# EAGLE design test_station (EAGLE 5.11)
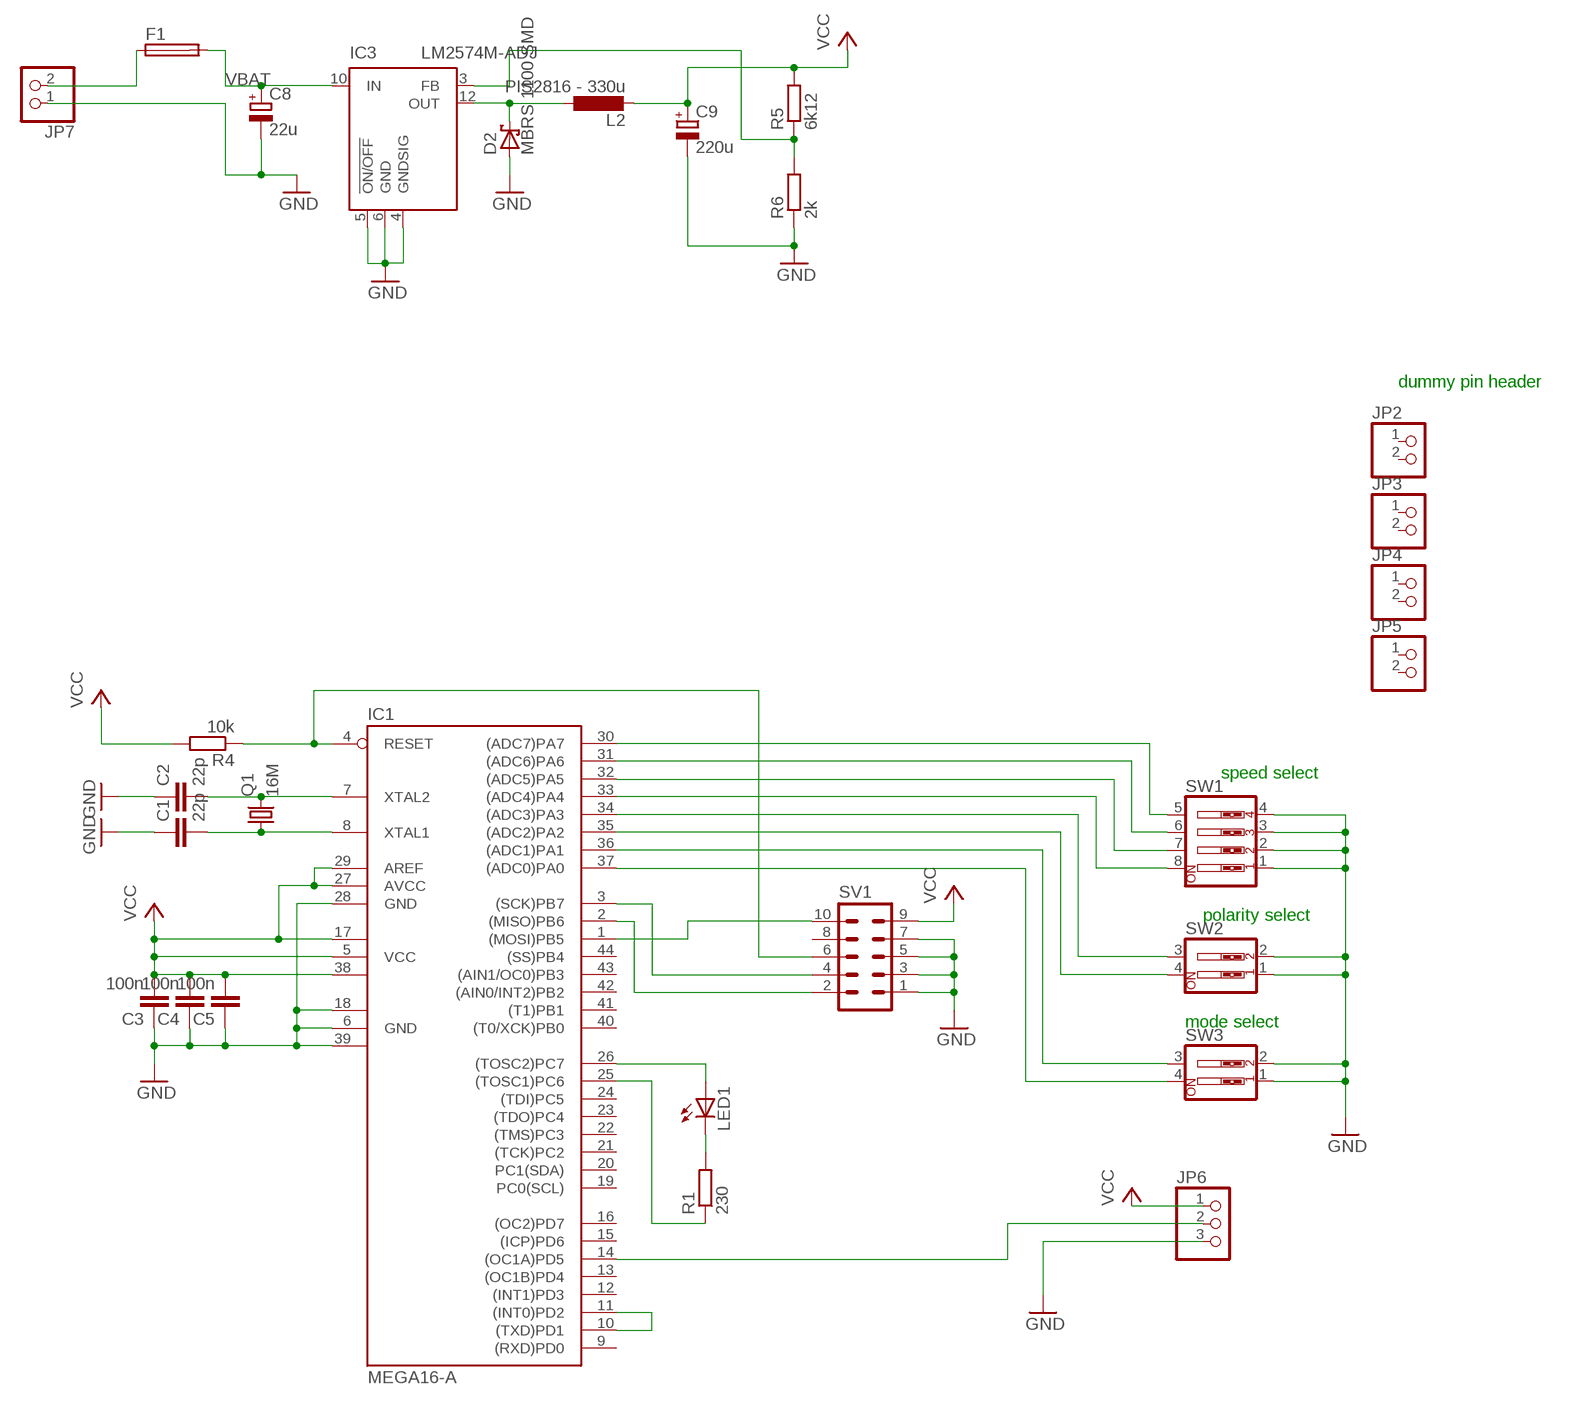
[diagram p0: schematic, sheet 1]

## Parts
C1  22p  C-EUC0805  [C0805]
C2  22p  C-EUC0805  [C0805]
C3  100n  C-EUC0805  [C0805]
C4  100n  C-EUC0805  [C0805]
C5  100n  C-EUC0805  [C0805]
C8  22u  CPOL-EUCT7343  [CT7343]
C9  220u  CPOL-EUD  [PANASONIC_D]
D2  MBRS 1100 SMD  MBRS130LT3  [SMB]
F1  SH22,5  [SH22,5]
IC1  MEGA16-A  [TQFP44]
IC3  LM2574M-ADJ  [SO14W]
JP2  PINHD-1X2  [1X02]
JP3  PINHD-1X2  [1X02]
JP4  PINHD-1X2  [1X02]
JP5  PINHD-1X2  [1X02]
JP6  PINHD-1X3  [1X03]
JP7  PINHD-1X2  [1X02]
L2  PIS2816 - 330u  PIS2816  [PIS2816]
LED1  LED3MM  [LED3MM]
Q1  16M  CRYSTALHC49U70  [HC49U70]
R1  230  R-EU_M0805  [M0805]
R4  10k  R-EU_M0805  [M0805]
R5  6k12  R-EU_M0805  [M0805]
R6  2k  R-EU_M0805  [M0805]
SV1  MA05-2  [MA05-2]
SW1  SW_DIP-4  [EDG-04]
SW2  SW_DIP-2  [EDG-02]
SW3  SW_DIP-2  [EDG-02]

## Nets
GND: C1.1 C2.1 C3.1 C4.1 C5.1 C8.- C9.- D2.A IC1.6(GND) IC1.18(GND1) IC1.28(GND) IC1.39(GND2) IC3.4(GNDSIG) IC3.5(!ON/OFF) IC3.6(GND) JP6.3 JP7.1 R6.1 SV1.1 SV1.3 SV1.5 SV1.7 SW1.1 SW1.2 SW1.3 SW1.4 SW2.1 SW2.2 SW3.1 SW3.2
N$1: IC1.30((ADC7)PA7) SW1.5
N$2: IC1.31((ADC6)PA6) SW1.6
N$3: IC1.32((ADC5)PA5) SW1.7
N$4: IC1.33((ADC4)PA4) SW1.8
N$5: IC1.34((ADC3)PA3) SW2.3
N$6: IC1.36((ADC1)PA1) SW3.3
N$7: IC1.10((TXD)PD1) IC1.11((INT0)PD2)
N$8: IC1.14((OC1A)PD5) JP6.2
N$9: IC1.4(RESET) R4.1 SV1.6
N$10: C1.2 IC1.8(XTAL1) Q1.1
N$11: C2.2 IC1.7(XTAL2) Q1.2
N$12: IC1.37((ADC0)PA0) SW3.4
N$13: IC1.35((ADC2)PA2) SW2.4
N$14: IC1.26((TOSC2)PC7) LED1.A
N$15: LED1.K(C) R1.2
N$16: IC1.25((TOSC1)PC6) R1.1
N$17: F1.1 JP7.2
N$18: IC3.3(FB) R5.1 R6.2
N$20: IC1.1((MOSI)PB5) SV1.10
N$21: IC1.3((SCK)PB7) SV1.4
N$23: IC1.2((MISO)PB6) SV1.2
N$24: D2.C IC3.12(OUT) L2.1
VBAT: C8.+ F1.2 IC3.10(IN)
VCC: C3.2 C4.2 C5.2 C9.+ IC1.5(VCC) IC1.17(VCC1) IC1.27(AVCC) IC1.29(AREF) IC1.38(VCC2) JP6.1 L2.2 R4.2 R5.2 SV1.9
Unconnected: IC1.9((RXD)PD0) IC1.12((INT1)PD3) IC1.13((OC1B)PD4) IC1.15((ICP)PD6) IC1.16((OC2)PD7) IC1.19(PC0(SCL)) IC1.20(PC1(SDA)) IC1.21((TCK)PC2) IC1.22((TMS)PC3) IC1.23((TDO)PC4) IC1.24((TDI)PC5) IC1.40((T0/XCK)PB0) IC1.41((T1)PB1) IC1.42((AIN0/INT2)PB2) IC1.43((AIN1/OC0)PB3) IC1.44((SS)PB4) JP2.1 JP2.2 JP3.1 JP3.2 JP4.1 JP4.2 JP5.1 JP5.2 SV1.8

## Notes on the sheet
- dummy pin header
- speed select
- polarity select
- mode select

## Library data of the parts
C1-C5 = rcl:C-EU: CAPACITOR, European symbol
C8 C9 = rcl:CPOL-EU: POLARIZED CAPACITOR, European symbol
D2 = diode:MBRS130LT3: Schottky Power Rectifier Source: http://www.onsemi.com/pub/Collateral/MBRS130LT3-D.PDF
F1 = fuse:SH22,5: FUSE HOLDER grid 22,5 mm, OGN0031 8201, Schurter (Buerklin); MF: SCHURTER; MPN: 0031.8201; OC_FARNELL: 1162740; OC_NEWARK: 96F8317
IC1 = atmel:MEGA16: MICROCONTROLLER 16 Kbytes FLASH 1 kbytes SRAM 512 bytes EEPROM USART 8-channel 10 bit ADC Source: avr.lbr
IC3 = linear:LM2574?-*: SIMPLE SWITCHER 0.5A Step-Down Voltage Regulator Source: http://cache.national.com/ds/LM/LM2574.pdf
JP2-JP5 JP7 = pinhead:PINHD-1X2: PIN HEADER
JP6 = pinhead:PINHD-1X3: PIN HEADER
L2 = Labor:PIS2816
LED1 = led1:LED: LED OSRAM: - CHIPLED LG R971, LG N971, LY N971, LG Q971, LY Q971, LO R971, LY R971 LH N974, LH R974 LS Q976, LO Q976, LY Q976 LO Q996 - Hyper CHIPLED LW Q18S LB Q993, LB Q99A, LB R99A - SideLED LS A670, LO A670, LY A670, LG A670, LP A670 LB A673, LV A673, LT A673, LW A673 LH A674 LY A675 LS A676, LA A676, LO A676, LY A676, LW A676 LS A679, LY A679, LG A679 - Hyper Micro SIDELED® LS Y876, LA Y876, LO Y876, LY Y876 LT Y87S - SmartLED LW L88C, LW L88S LB L89C, LB L89S, LG L890 LS L89K, LO L89K, LY L89K LS L896, LA L896, LO L896, LY L896 - TOPLED LS T670, LO T670, LY T670, LG T670, LP T670 LSG T670, LSP T670, LSY T670, LOP T670, LYG T670 LG T671, LOG T671, LSG T671 LB T673, LV T673, LT T673, LW T673 LH T674 LS T676, LA T676, LO T676, LY T676, LB T676, LH T676, LSB T676, LW T676 LB T67C, LV T67C, LT T67C, LS T67K, LO T67K, LY T67K, LW E67C LS E67B, LA E67B, LO E67B, LY E67B, LB E67C, LV E67C, LT E67C LW T67C LS T679, LY T679, LG T679 LS T770, LO T770, LY T770, LG T770, LP T770 LB T773, LV T773, LT T773, LW T773 LH T774 LS E675, LA E675, LY E675, LS T675 LS T776, LA T776, LO T776, LY T776, LB T776 LHGB T686 LT T68C, LB T68C - Hyper Mini TOPLED® LB M676 - Mini TOPLED Santana® LG M470 LS M47K, LO M47K, LY M47K Source: http://www.osram.convergy.de - LUMILED® LXK2-PW12-R00, LXK2-PW12-S00, LXK2-PW14-U00, LXK2-PW14-V00 LXK2-PM12-R00, LXK2-PM12-S00, LXK2-PM14-U00 LXK2-PE12-Q00, LXK2-PE12-R00, LXK2-PE12-S00, LXK2-PE14-T00, LXK2-PE14-U00 LXK2-PB12-K00, LXK2-PB12-L00, LXK2-PB12-M00, LXK2-PB14-N00, LXK2-PB14-P00, LXK2-PB14-Q00 LXK2-PR12-L00, LXK2-PR12-M00, LXK2-PR14-Q00, LXK2-PR14-R00 LXK2-PD12-Q00, LXK2-PD12-R00, LXK2-PD12-S00 LXK2-PH12-R00, LXK2-PH12-S00 LXK2-PL12-P00, LXK2-PL12-Q00, LXK2-PL12-R00 Source: www.luxeon.com
Q1 = crystal:CRYSTAL: CRYSTAL
R1 R4-R6 = rcl:R-EU_: RESISTOR, European symbol
SV1 = con-lstb:MA05-2: PIN HEADER
SW1 = special:SW_DIP-4: DIP SWITCH
SW2 SW3 = special:SW_DIP-2: DIP SWITCH

## Board
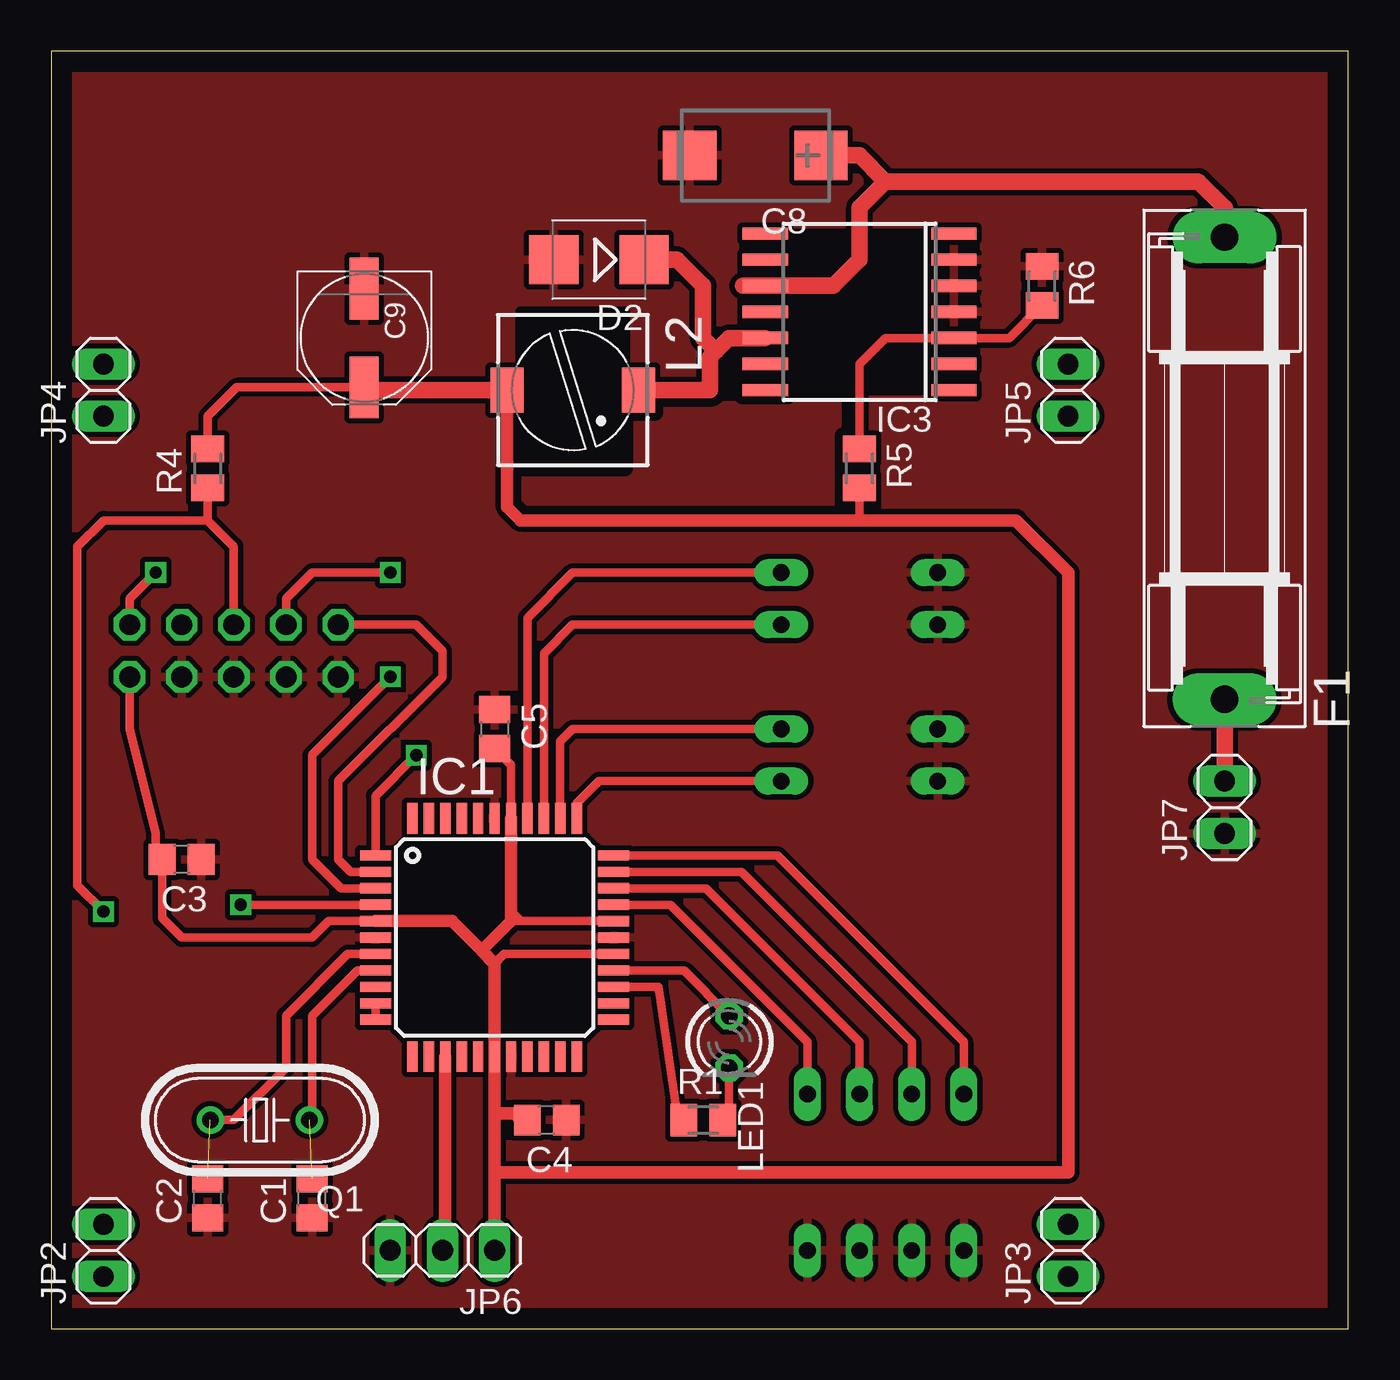
[diagram p1: board, top side]
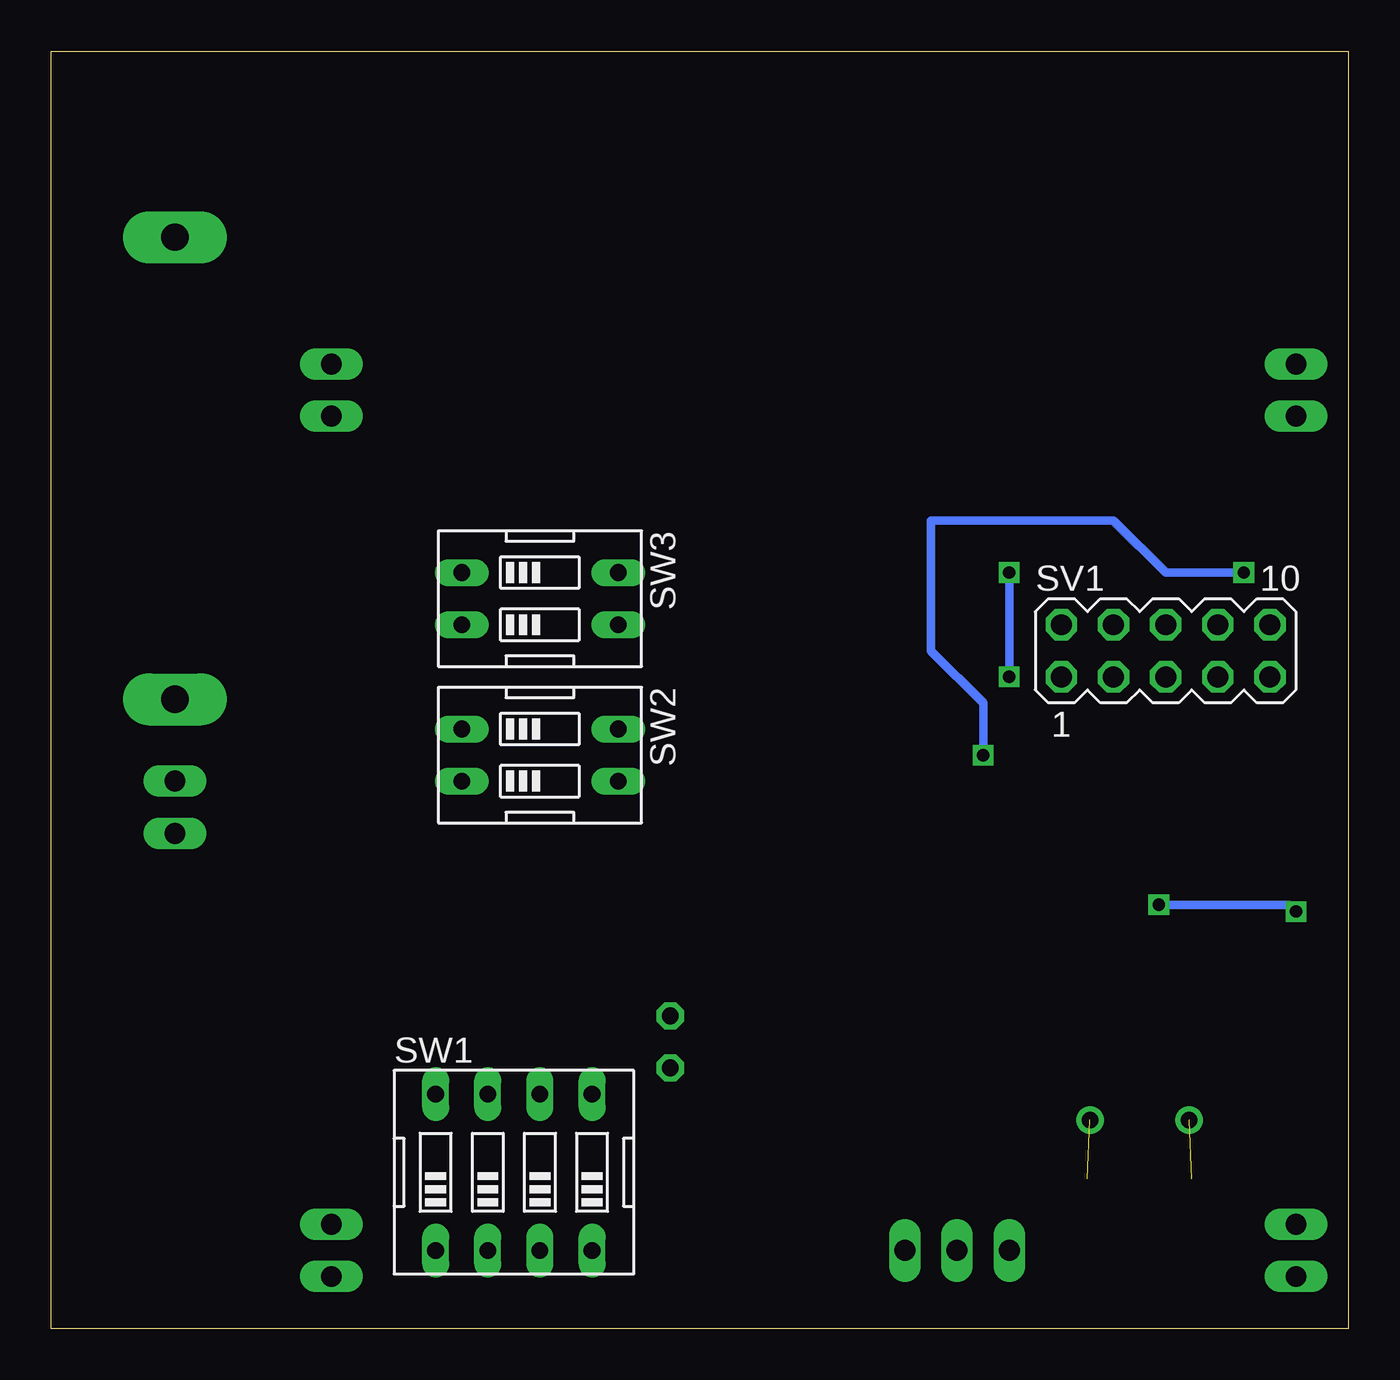
[diagram p2: board, bottom side, seen from below]

Size 63.17 x 62.22 mm. Coordinates in mm from the lower left corner, seen from the top.
Outline: 0,0 63.17,0 63.17,62.22 0,62.22 0,0
Copper layers (1*16): Top 0.035mm / dielectric 1.5mm / Bottom 0.035mm
Design rules "default": minimum track width 10mil, minimum drill 24mil, track to track 8mil, track to pad 8mil, pad to pad 8mil, via to via 8mil, smd to smd 8mil, copper to edge 40mil, drill to drill 8mil, minimum pad ring 10mil, minimum via ring 8mil, stop-mask expansion 4mil, vias tented up to drill 0mil, thermal gap 10mil
tRestrict: area 35.6,45.7 to 43.2,53.3; area 16.8,14.1 to 21.1,19.4; area 22.1,14.2 to 26.5,17.9; area 22.9,20.3 to 26.5,23.9; area 16.8,19.2 to 21.9,24

### Footprints (pad centres in the part's own frame; a part is rotated, then mirrored left to right if it is on the bottom)
C0805 = smd 1.3 x 1.5: 1 -0.95,0; 2 0.95,0
CT7343 = smd 2.6 x 2.4: + -3.2,0; - 3.2,0
PANASONIC_D = smd 3 x 1.4: + 2.4,0; - -2.4,0
SMB = smd 2.4 x 2.4: A 2.2,0; C -2.2,0
SH22,5 = drill 1.321 pad 2.54 long: 1 -11.252,0; 2 11.252,0
TQFP44 = smd 1.5 x 0.5: 1 -5.8,4; 2 -5.8,3.2; 3 -5.8,2.4; 4 -5.8,1.6; 5 -5.8,0.8; 6 -5.8,0; 7 -5.8,-0.8; 8 -5.8,-1.6; 9 -5.8,-2.4; 10 -5.8,-3.2; 11 -5.8,-4; 23 5.8,-4; 24 5.8,-3.2; 25 5.8,-2.4; 26 5.8,-1.6; 27 5.8,-0.8; 28 5.8,0; 29 5.8,0.8; 30 5.8,1.6; 31 5.8,2.4; 32 5.8,3.2; 33 5.8,4 | smd 0.5 x 1.5: 12 -4,-5.8; 13 -3.2,-5.8; 14 -2.4,-5.8; 15 -1.6,-5.8; 16 -0.8,-5.8; 17 0,-5.8; 18 0.8,-5.8; 19 1.6,-5.8; 20 2.4,-5.8; 21 3.2,-5.8; 22 4,-5.8; 34 4,5.8; 35 3.2,5.8; 36 2.4,5.8; 37 1.6,5.8; 38 0.8,5.8; 39 0,5.8; 40 -0.8,5.8; 41 -1.6,5.8; 42 -2.4,5.8; 43 -3.2,5.8; 44 -4,5.8
SO14W = smd 0.6 x 2.2: 1 -3.81,-4.6; 2 -2.54,-4.6; 3 -1.27,-4.6; 4 0,-4.6; 5 1.27,-4.6; 6 2.54,-4.6; 7 3.81,-4.6; 8 3.81,4.6; 9 2.54,4.6; 10 1.27,4.6; 11 0,4.6; 12 -1.27,4.6; 13 -2.54,4.6; 14 -3.81,4.6
1X02 = drill 1.016 long: 1 -1.27,0; 2 1.27,0
1X03 = drill 1.016 long: 1 -2.54,0; 2 0,0; 3 2.54,0
PIS2816 = smd 2.2 x 1.6: 1 0,3.2; 2 0,-3.2
LED3MM = drill 0.813 octagon: A -1.27,0; K 1.27,0
HC49U70 = drill 0.813 round: 1 -2.413,0; 2 2.413,0
M0805 = smd 1.3 x 1.6: 1 -0.95,0; 2 0.95,0
MA05-2 = drill 1.016 octagon: 1 -5.08,-1.27; 2 -5.08,1.27; 3 -2.54,-1.27; 4 -2.54,1.27; 5 0,-1.27; 6 0,1.27; 7 2.54,-1.27; 8 2.54,1.27; 9 5.08,-1.27; 10 5.08,1.27
EDG-04 = drill 0.813 long: 1 -3.81,-3.81; 2 -1.27,-3.81; 3 1.27,-3.81; 4 3.81,-3.81; 5 3.81,3.81; 6 1.27,3.81; 7 -1.27,3.81; 8 -3.81,3.81
EDG-02 = drill 0.813 long: 1 -1.27,-3.81; 2 1.27,-3.81; 3 1.27,3.81; 4 -1.27,3.81

### Placement (x,y rotation side)
C1  12.7,6.35 90 top
C2  7.62,6.35 90 top
C3  6.35,22.86 180 top
C4  24.13,10.16 180 top
C5  21.59,29.21 270 top
C8  34.29,57.15 180 top
C9  15.24,48.26 270 top
D2  26.67,52.07 180 top
F1  57.15,41.91 90 top
IC1  21.59,19.05 0 top
IC3  39.37,49.53 90 top
JP2  2.54,3.81 90 top
JP3  49.53,3.81 90 top
JP4  2.54,45.72 90 top
JP5  49.53,45.72 90 top
JP6  19.05,3.81 180 top
JP7  57.15,25.4 90 top
L2  25.4,45.72 270 top
LED1  33.02,13.97 270 top
Q1  10.16,10.16 180 top
R1  31.75,10.16 0 top
R4  7.62,41.91 90 top
R5  39.37,41.91 270 top
R6  48.26,50.8 270 top
SV1  8.89,33.02 0 bottom
SW1  40.64,7.62 0 bottom
SW2  39.37,27.94 270 bottom
SW3  39.37,35.56 270 bottom

### Tracks (layer width: path | path; a pad name or v marks a point on that pad's centre or on a via)
GND
  pour Top (isolate 0.254): 0,62.23 0,0 62.23,0 62.23,62.23
N$1
  Top 0.406: IC1.30 30.15,20.65 36.83,13.97 SW1.5
N$2
  Top 0.406: IC1.31 31.89,21.45 39.37,13.97 SW1.6
N$3
  Top 0.406: IC1.32 33.63,22.25 41.91,13.97 SW1.7
N$4
  Top 0.406: IC1.33 35.37,23.05 44.45,13.97 SW1.8
N$5
  Top 0.406: IC1.34 25.59,25.59 26.67,26.67 SW2.3
N$6
  Top 0.406: IC1.36 23.99,32.88 25.4,34.29 SW3.3
N$7
  Top 0.406: IC1.11 IC1.10
N$8
  Top 0.61: IC1.14 19.19,3.95 19.05,4.09 JP6.2
N$9  (via drill 0.6)
  Top 0.406: 7.62,39.37 2.54,39.37 1.27,38.1 1.27,21.59 v2.54,20.32 | 7.62,39.37 8.89,38.1 SV1.6 | v9.22,20.65 IC1.4 | 7.62,39.37 R4.1
  Bottom 0.406: v9.22,20.65 2.87,20.65 v2.54,20.32
N$10  (1 unrouted)
  Top 0.406: IC1.8 14.91,17.45 12.7,15.24 12.7,10.29 Q1.1
N$11  (1 unrouted)
  Top 0.406: IC1.7 14.44,18.25 11.43,15.24 11.43,12.7 8.89,10.16 Q1.2
N$12
  Top 0.406: IC1.37 23.19,34.62 25.4,36.83 SW3.4
N$13
  Top 0.406: IC1.35 24.79,28.6 25.4,29.21 SW2.4
N$14
  Top 0.406: IC1.26 30.81,17.45 LED1.A
N$15
  Top 0.406: LED1.K 33.02,10.48 R1.2
N$16
  Top 0.406: IC1.25 27.8,16.65 29.58,16.64 30.48,10.48 R1.1
N$17
  Top 0.813: JP7.2 F1.1
N$18
  Top 0.406: R6.2 46.67,48.26 IC3.3 40.64,48.26 39.37,46.99 R5.1
N$20  (via drill 0.6)
  Top 0.406: SV1.10 3.81,35.56 v5.08,36.83 | IC1.1 15.79,25.95 v17.78,27.94
  Bottom 0.406: v5.08,36.83 8.89,36.83 11.43,39.37 20.32,39.37 20.32,33.02 17.78,30.48 v17.78,27.94
N$21  (via drill 0.6)
  Top 0.406: IC1.3 14.11,21.45 12.7,22.86 12.7,27.94 v16.51,31.75 | SV1.4 11.43,35.56 12.7,36.83 v16.51,36.83
  Bottom 0.406: v16.51,31.75 v16.51,36.83
N$22
  pour Top (isolate 0.406): 21.59,46.99 21.59,39.37 38.1,39.37 38.1,46.99
N$23
  Top 0.406: IC1.2 14.58,22.25 13.97,22.86 13.97,26.67 19.05,31.75 19.05,33.02 17.78,34.29 SV1.2
N$24
  Top 0.813: IC3.12 33.02,48.26 32.38,47.62 | 32.38,47.62 32.09,47.33 32.09,45.72 L2.1 | D2.C 30.48,52.07 31.75,50.8 31.75,48.26 32.38,47.62
VBAT
  Top 0.813: 33.68,50.8 IC3.10 38.1,50.8 39.37,52.07 39.37,54.61 40.64,55.88 | 40.64,55.88 55.88,55.88 57.15,54.61 F1.2 | C8.+ 39.37,57.15 40.64,55.88
VCC
  Top 0.406: IC1.27 22.06,18.25 21.59,17.78 | 22.39,19.85 22.86,19.85 | 22.86,19.85 IC1.29 | 22.39,20.32 22.86,19.85 | SV1.9 3.81,29.21 5.08,24.13 5.08,23.18 C3.2 5.4,20 6.35,19.05 12.7,19.05 13.5,19.85 IC1.5 | IC1.38 22.39,27.46 C5.2 | R4.2 7.62,44.45 9.03,45.86 C9.+ | 39.37,39.37 R5.2
  Top 0.61: IC1.5 19.52,19.85 20.95,18.41 | 20.95,18.41 21.59,17.78 IC1.17 21.59,10.48 | IC1.38 22.39,20.32 22.39,19.85 20.95,18.41 | JP6.1 21.59,7.62 | 21.59,7.62 21.59,10.48 | 21.59,7.62 49.53,7.62 49.53,36.83 46.99,39.37 39.37,39.37 22.86,39.37 22.2,40.03 L2.2 | 21.59,10.48 22.54,10.48 22.86,10.16 C4.2
  Top 0.813: L2.2 15.38,45.72 C9.+